# EasyEDA schematic SCH_555-timer-LED-Chaser_2025-11-26.json
TITLE: LED Chaser with 555 Timer and CD4017; REV: 1.0; Date: 2025-11-26; Sheet: 1/1; Drawn By: kaushikc2008; Company: Kaushik Chandolu
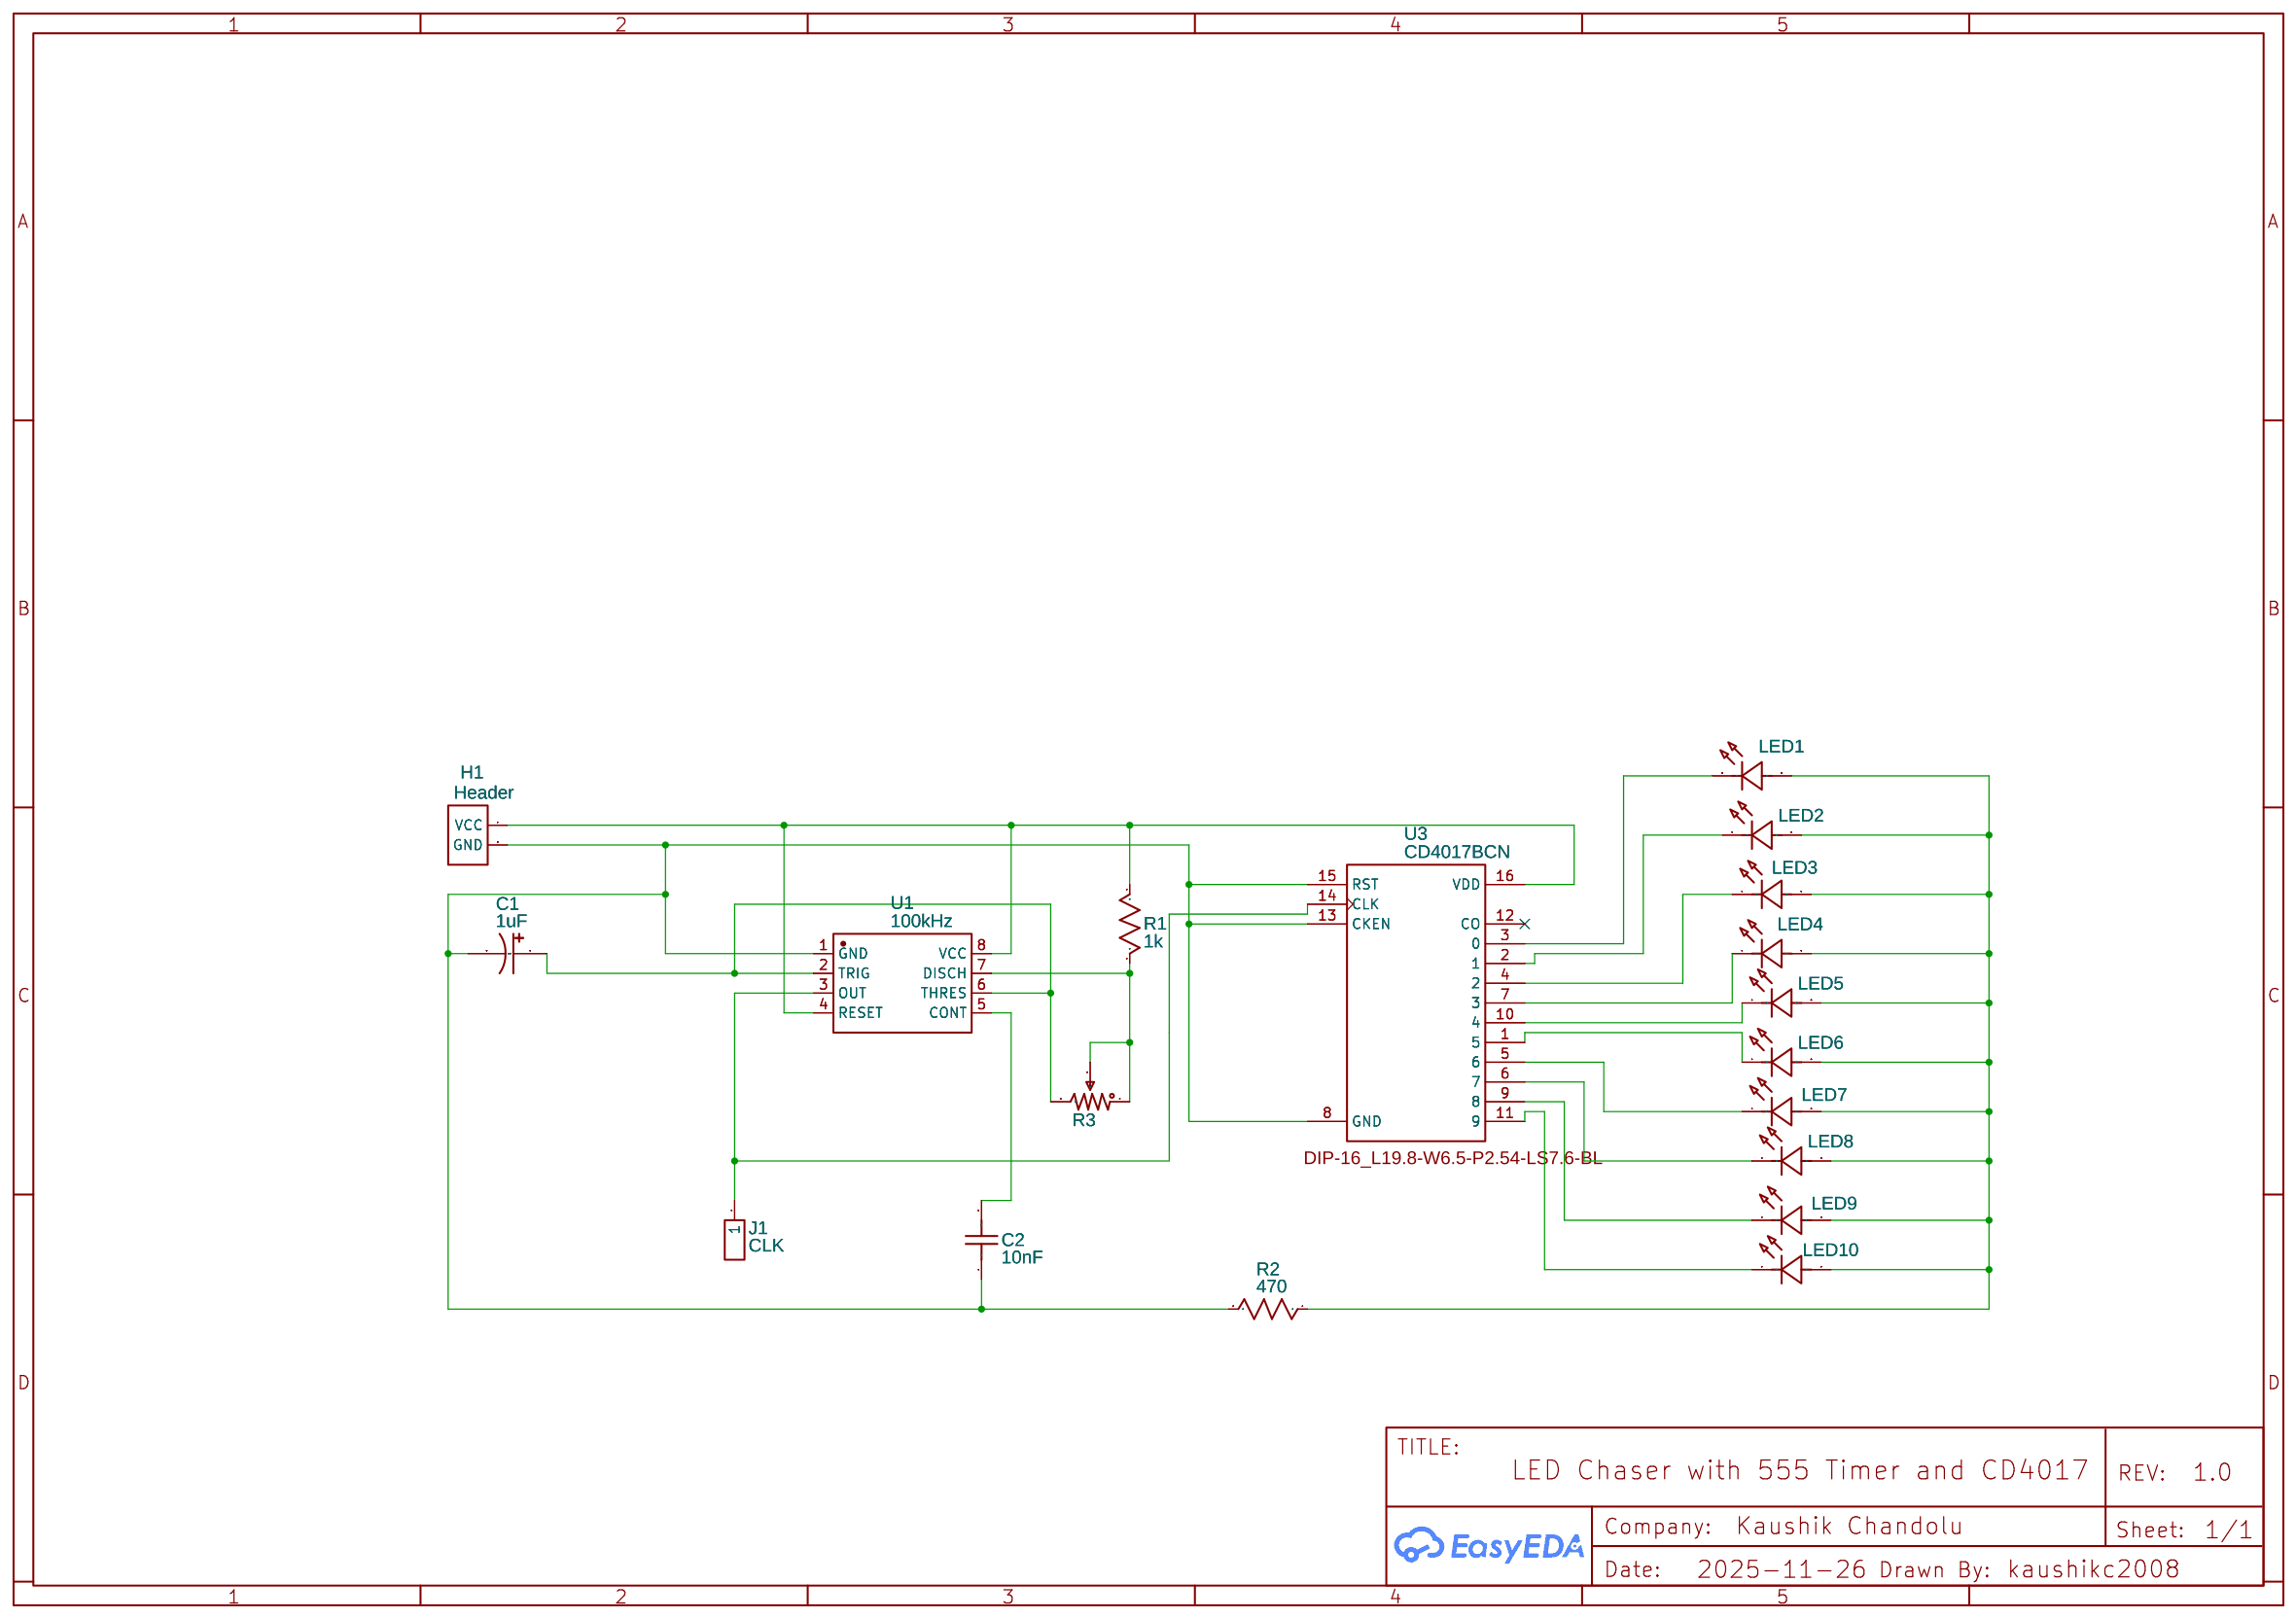
[diagram p0: schematic sheet]

## Parts
C1  1uF  [CAP-TH_BD5.0-P2.00-D0.8-FD]
C2  10nF  [CAP-TH_L8.0-W4.0-P5.00-D1.2]
H1  Header  [HDR-M-2.54_1X2]
J1  CLK  [HDR-M-2.54_1X1]
LED1  XL-502UWC  [LED-TH_BD5.9-P2.54-RD_WHITE]
LED2  XL-502UWC  [LED-TH_BD5.9-P2.54-RD_WHITE]
LED3  XL-502UWC  [LED-TH_BD5.9-P2.54-RD_WHITE]
LED4  XL-502UWC  [LED-TH_BD5.9-P2.54-RD_WHITE]
LED5  XL-502UWC  [LED-TH_BD5.9-P2.54-RD_WHITE]
LED6  XL-502UWC  [LED-TH_BD5.9-P2.54-RD_WHITE]
LED7  XL-502UWC  [LED-TH_BD5.9-P2.54-RD_WHITE]
LED8  XL-502UWC  [LED-TH_BD5.9-P2.54-RD_WHITE]
LED9  XL-502UWC  [LED-TH_BD5.9-P2.54-RD_WHITE]
LED10  XL-502UWC  [LED-TH_BD5.9-P2.54-RD_WHITE]
R1  1k  [R_AXIAL-0.4]
R2  470  [R_AXIAL-0.3]
R3  R_3386P_US  [RES-ADJ-TH_3386P]
U1  100kHz  [DIP-8_L9.8-W6.6-P2.54-LS7.6-BL]
U3  CD4017BCN  [DIP-16_L19.8-W6.5-P2.54-LS7.6-BL]

## Library data of the parts
C1 = UVZ1H010MDD: Contributor: aquawarrior; Supplier: LCSC; Supplier Part: C62934; Manufacturer: Nichicon(尼吉康)
C2 = CAP 10nF HV: Supplier: LCSC; Supplier Part: C249157; Manufacturer: Songtian Elec; Manufacturer Part: N09F1B103MN0B0S0N0; Contributor: thien1900; JLCPCB Part Class: Extended Part
H1 = HEADER-FEMALE-2.54_1X2: Contributor: aquawarrior; Supplier: LCSC; Supplier Part: C492401; Package Display: No
J1 = HDR-M-2.54_1x1: Supplier Part: C81276; Supplier: LCSC; Contributor: Sudhir Kumar; Package Display: No
LED1-LED10 = XL-502UWC: Contributor: LCSC; Supplier: LCSC; Supplier Part: C2895480; Manufacturer: XINGLIGHT(成兴光); JLCPCB Part Class: Extended Part
R1 = R_0603_US: Supplier Part: C713997; Supplier: LCSC; Contributor: farizki29; Manufacturer Part: MF1/4W-1KΩ±1%T52; Manufacturer: Huaxing Mechanical-Elec.
R2 = Resistor: Manufacturer Part: ?; Supplier Part: C58592; Supplier: LCSC; Contributor: aquawarrior
R3 = R_3386P_US: Supplier Part: C118912; Supplier: LCSC; Contributor: LCEDA_Lib; value(Ω): 50k; Package Display: No
U1 = NE555P: Supplier: LCSC; Manufacturer: TI(德州仪器); Supplier Part: C46749; JLCPCB Part Class: Extended Part
U3 = CD4017BCN: Decade CounterDivider with 10 Decoded Outputs; Supplier: LCSC; Supplier Part: C32710674; Package Display: Yes; Contributor: aquawarrior

## Nets
Net-(C1-1): C1.1 R3.3 U1.2(TRIG) U1.6(THRES)
Net-(C1-2): C1.2 C2.1 H1.2(GND) R2.2 U1.1(GND) U3.8(GND) U3.13(CKEN) U3.15(RST)
Net-(C2-2): C2.2 U1.5(CONT)
Net-(H1-1): H1.1(VCC) R1.2 U1.4(RESET) U1.8(VCC) U3.16(VDD)
Net-(J1-1): J1.1 U1.3(OUT) U3.14(CLK)
Net-(LED1-1): LED1.1(K) U3.3(0)
Net-(LED1-2): LED1.2(A) LED2.2(A) LED3.2(A) LED4.2(A) LED5.2(A) LED6.2(A) LED7.2(A) LED8.2(A) LED9.2(A) LED10.2(A) R2.1
Net-(LED2-1): LED2.1(K) U3.2(1)
Net-(LED3-1): LED3.1(K) U3.4(2)
Net-(LED4-1): LED4.1(K) U3.7(3)
Net-(LED5-1): LED5.1(K) U3.10(4)
Net-(LED6-1): LED6.1(K) U3.1(5)
Net-(LED7-1): LED7.1(K) U3.5(6)
Net-(LED8-1): LED8.1(K) U3.6(7)
Net-(LED9-1): LED9.1(K) U3.9(8)
Net-(LED10-1): LED10.1(K) U3.11(9)
Net-(R1-1): R1.1 R3.1 R3.2 U1.7(DISCH)

Not connected (* = marked no-connect by the designer): U3 12(CO)*
